# Altium schematic sheet V2.0.SchDoc
size 139 x 88 mm
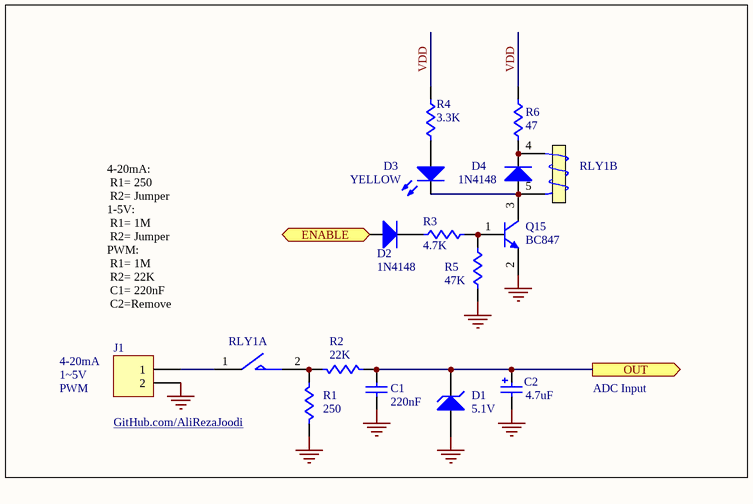
[diagram p0: V2.0.SchDoc]

## Parts
C1  220nF  [CAPNTO2.54-3.05x1.78A]
C2  4.7uF  [CAPPR2.5-6.3x5]
D1  5.1V  [DIODE0.4_Glass]
D2  value 1N4148  [0805_Diode]  (hidden comment: Diode)
D3  YELLOW  [0805_Diode]
D4  value 1N4148  [0805_Diode]  (hidden comment: Diode)
J1  Header 2  [Fonics_2PIN_1]  (value not drawn)
Q1  Q15  value BC847  [SOT23-3N]
R1  250  [AXIAL-0.4]
R2  22K  [AXIAL-0.4]
R3  value 4.7K  [0805]  (hidden comment: Res1)
R4  value 3.3K  [0805]  (hidden comment: Res1)
R5  value 47K  [0805]  (hidden comment: Res1)
R6  47  [RESC3216N]
RLY1  RELAU  [RELAY-SPDT-2]  (value not drawn)  (parts A,B of 2)

## Ports
ENABLE (in), OUT (out)

## Nets
GND: C1.1 C2.2 D1.1(A) J1.2 Q1.2(E) R1.2 R5.1
ENABLE: D2.1(A) ; port ENABLE
OUT: C1.2 C2.1 D1.2(K) R2.2 ; port OUT
VDD: R4.1 R6.1
NetD2_2: D2.2(K) R3.1
NetD3_1: D3.1(A) R4.2
NetD3_2: D3.2(K) D4.1(A) Q1.3(C) RLY1.5(T2)
NetD4_2: D4.2(K) R6.2 RLY1.4(T1)
NetJ1_1: J1.1 RLY1.1(COM)
NetQ1_1: Q1.1(B) R3.2 R5.2
NetR1_1: R1.1 R2.1 RLY1.2(NO)

## Notes on the sheet
- 4-20mA
- 4-20mA:
  R1= 250
  R2= Jumper
  1-5V:
  R1= 1M
  R2= Jumper
  PWM:
  R1= 1M
  R2= 22K
  C1= 220nF
  C2=Remove
- 1~5V
- PWM
- GitHub.com/AliRezaJoodi
- ADC Input

## Library data of the parts
C1 = Cap: Capacitor; Manufacturer: Generic Components; Class I: Passive; Published: 8-Jun-2000; Revision: July-2002: Re-released for DXP Platform.; Publisher: Altium Limited; Class II: Capacitor
C2 = Cap Pol1: Polarized Capacitor (Radial); Manufacturer: Generic Components; Class I: Passive; Published: 8-Jun-2000; Revision: July-2002: Re-released for DXP Platform.; Publisher: Altium Limited; Class II: Capacitor
D1 = D Zener: Zener Diode; Manufacturer: Generic Components; Class I: Discrete; Class II: Diode - Zener; Published: 8-Jun-2000; Revision: July-2002: Re-released for DXP Platform.; Publisher: Altium Limited
D2 D4 = Diode: Default Diode; Manufacturer: Generic Components; Class I: Discrete; Class II: Diode - Switching; Published: 8-Jun-2000; Revision: July-2002: Re-released for DXP Platform.; Publisher: Altium Limited
D3 = LED: Typical INFRARED GaAs LED; Manufacturer: Generic Components; Class I: Optoelectronic; Published: 8-Jun-2000; Revision: July-2002: Re-released for DXP Platform.; Publisher: Altium Limited; Class II: LED
J1 = Header 2: Header, 2-Pin; LatestRevisionDate: 17-Jul-2002; LatestRevisionNote: Re-released for DXP Platform.; Publisher: Altium Limited
Q1 = BC847: Silicon Bipolar Transistor
R1-R6 = Res1: Resistor; Manufacturer: Generic Components; Class I: Passive; Published: 8-Jun-2000; Revision: July-2002: Re-released for DXP Platform.; Publisher: Altium Limited; Class II: Resistor
RLY1 = RELAY-NY12W-K: Value: LM358; Published: 17-Jul-2002; LatestRevisionDate: 13-Apr-2006; LatestRevisionNote: IPC-7351 Footprint Added.; DatasheetVersion: 1988; PackageReference: 751-02; Publisher: Altium Limited; PackageDescription: 8-Pin Small Outline Integrated Circuit 1.27 mm Pitch; Code_JEDEC: MS-012-AA; Code_IPC: SOIC127P600-8; ComponentLink1Description: Manufacturer Link; ComponentLink1URL: http://www.onsemi.com/site/products/parametrics/0,4446,251,00.html; ComponentLink2Description: Datasheet; ComponentLink2URL: http://www.onsemi.com/pub/Collateral/LM358-D.PDF